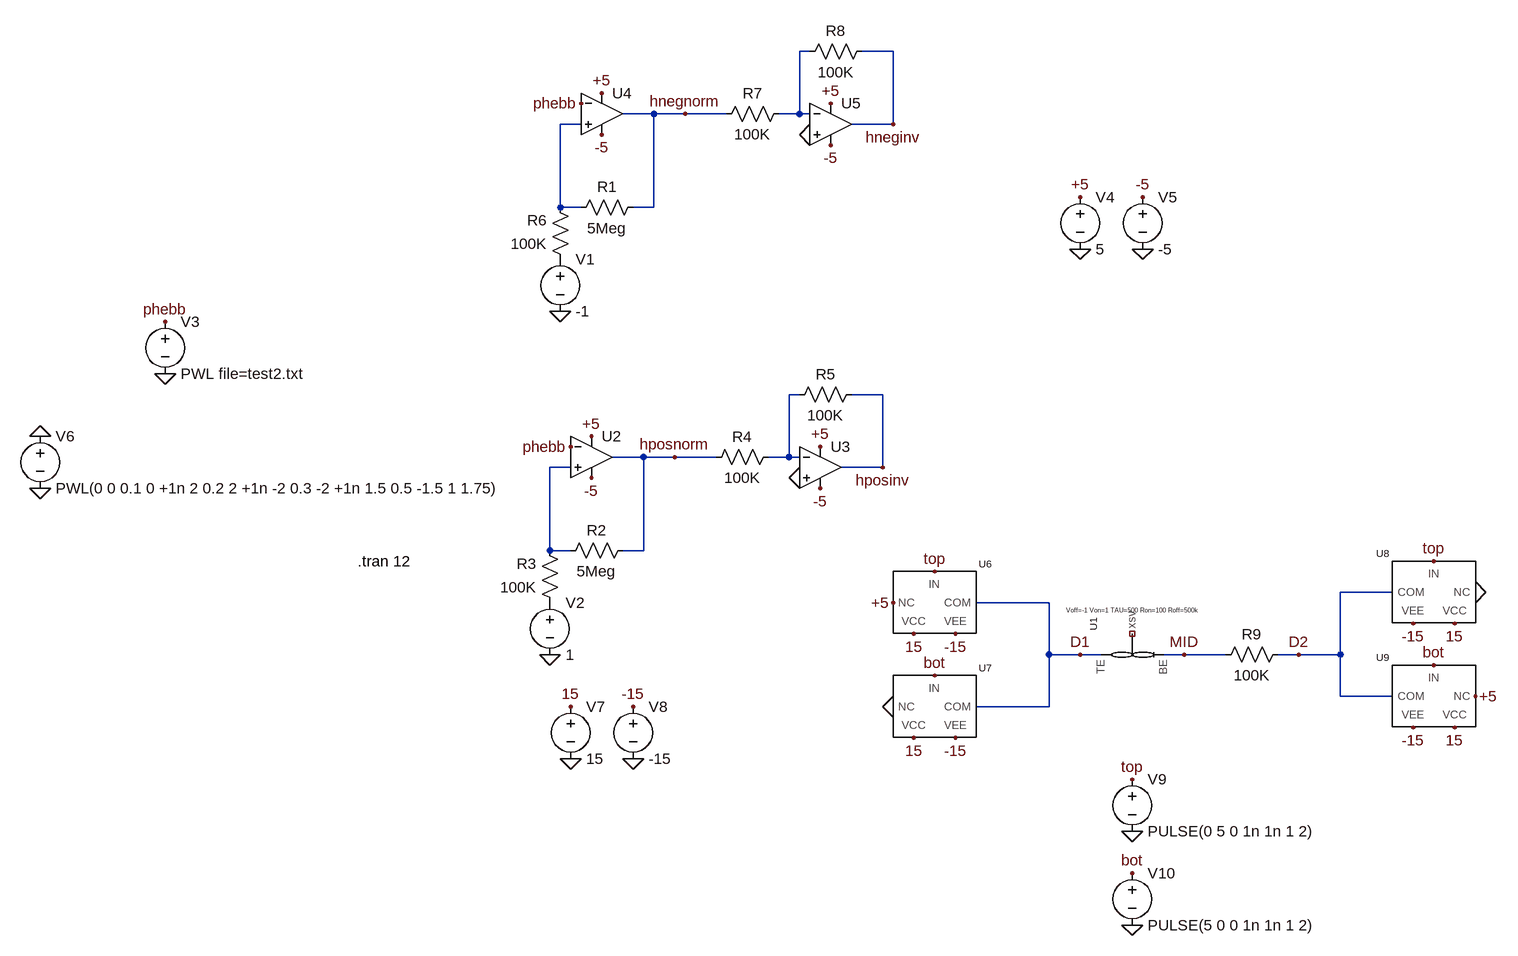
[diagram p0: schematic Draft1.asc]
Draft1.asc, the LTspice schematic file:
Version 4
SHEET 1 1284 1088
WIRE 128 -448 112 -448
WIRE 256 -448 208 -448
WIRE -112 -352 -160 -352
WIRE -64 -352 -112 -352
WIRE 0 -352 -64 -352
WIRE 112 -352 112 -448
WIRE 112 -352 80 -352
WIRE 128 -352 112 -352
WIRE -224 -336 -256 -336
WIRE 256 -336 256 -448
WIRE 256 -336 192 -336
WIRE -256 -208 -256 -336
WIRE -224 -208 -256 -208
WIRE -112 -208 -112 -352
WIRE -112 -208 -144 -208
WIRE 112 80 96 80
WIRE 240 80 192 80
WIRE -128 176 -176 176
WIRE -80 176 -128 176
WIRE -16 176 -80 176
WIRE 96 176 96 80
WIRE 96 176 64 176
WIRE 112 176 96 176
WIRE -240 192 -272 192
WIRE 240 192 240 80
WIRE 240 192 176 192
WIRE -272 320 -272 192
WIRE -240 320 -272 320
WIRE -128 320 -128 176
WIRE -128 320 -160 320
WIRE 1024 384 944 384
WIRE 496 400 384 400
WIRE 496 480 496 400
WIRE 544 480 496 480
WIRE 576 480 544 480
WIRE 704 480 672 480
WIRE 768 480 704 480
WIRE 880 480 848 480
WIRE 944 480 944 384
WIRE 944 480 880 480
WIRE 944 544 944 480
WIRE 1024 544 944 544
WIRE 496 560 496 480
WIRE 496 560 384 560
FLAG -208 144 +5
FLAG -272 480 0
FLAG 112 208 0
FLAG 144 160 +5
FLAG -80 176 hposnorm
FLAG 240 192 hposinv
FLAG -864 48 0
FLAG -864 -32 phebb
FLAG -192 -384 +5
FLAG -256 -48 0
FLAG 128 -320 0
FLAG 160 -368 +5
FLAG -64 -352 hnegnorm
FLAG 256 -336 hneginv
FLAG -240 160 phebb
FLAG -224 -368 phebb
FLAG 544 -224 +5
FLAG 640 -224 -5
FLAG 544 -144 0
FLAG 640 -144 0
FLAG 160 -304 -5
FLAG -192 -320 -5
FLAG -208 208 -5
FLAG 144 224 -5
FLAG -1056 224 0
FLAG -1056 144 0
FLAG -240 640 0
FLAG -144 640 0
FLAG -240 560 15
FLAG -144 560 -15
FLAG 352 448 -15
FLAG 288 448 15
FLAG 256 400 +5
FLAG 256 560 0
FLAG 544 480 D1
FLAG 880 480 D2
FLAG 704 480 MID
FLAG 288 608 15
FLAG 352 608 -15
FLAG 1056 592 -15
FLAG 1120 592 15
FLAG 1152 544 +5
FLAG 1152 384 0
FLAG 1120 432 15
FLAG 1056 432 -15
FLAG 320 352 top
FLAG 1088 336 top
FLAG 320 512 bot
FLAG 1088 496 bot
FLAG 624 752 0
FLAG 624 896 0
FLAG 624 672 top
FLAG 624 816 bot
SYMBOL memristor_with_state 624 480 R270
WINDOW 3 68 0 VCenter 0
SYMATTR Value Voff=-1 Von=1 TAU=500 Ron=100 Roff=500k
SYMATTR InstName U1
SYMBOL Opamps\\UniversalOpamp2 -208 176 R0
SYMATTR InstName U2
SYMBOL res -144 304 R90
WINDOW 0 0 56 VBottom 2
WINDOW 3 32 56 VTop 2
SYMATTR InstName R2
SYMATTR Value 5Meg
SYMBOL res -256 416 R180
WINDOW 0 36 76 Left 2
WINDOW 3 36 40 Left 2
SYMATTR InstName R3
SYMATTR Value 100K
SYMBOL voltage -272 384 R0
WINDOW 123 0 0 Left 2
WINDOW 39 0 0 Left 2
SYMATTR InstName V2
SYMATTR Value 1
SYMBOL Opamps\\UniversalOpamp2 144 192 R0
SYMATTR InstName U3
SYMBOL res 80 160 R90
WINDOW 0 0 56 VBottom 2
WINDOW 3 32 56 VTop 2
SYMATTR InstName R4
SYMATTR Value 100K
SYMBOL res 208 64 R90
WINDOW 0 0 56 VBottom 2
WINDOW 3 32 56 VTop 2
SYMATTR InstName R5
SYMATTR Value 100K
SYMBOL voltage -864 -48 R0
WINDOW 123 0 0 Left 2
WINDOW 39 0 0 Left 2
SYMATTR InstName V3
SYMATTR Value PWL file=test2.txt
SYMBOL Opamps\\UniversalOpamp2 -192 -352 R0
SYMATTR InstName U4
SYMBOL res -128 -224 R90
WINDOW 0 0 56 VBottom 2
WINDOW 3 32 56 VTop 2
SYMATTR InstName R1
SYMATTR Value 5Meg
SYMBOL res -240 -112 R180
WINDOW 0 36 76 Left 2
WINDOW 3 36 40 Left 2
SYMATTR InstName R6
SYMATTR Value 100K
SYMBOL voltage -256 -144 R0
WINDOW 123 0 0 Left 2
WINDOW 39 0 0 Left 2
SYMATTR InstName V1
SYMATTR Value -1
SYMBOL Opamps\\UniversalOpamp2 160 -336 R0
SYMATTR InstName U5
SYMBOL res 96 -368 R90
WINDOW 0 0 56 VBottom 2
WINDOW 3 32 56 VTop 2
SYMATTR InstName R7
SYMATTR Value 100K
SYMBOL res 224 -464 R90
WINDOW 0 0 56 VBottom 2
WINDOW 3 32 56 VTop 2
SYMATTR InstName R8
SYMATTR Value 100K
SYMBOL voltage 544 -240 R0
WINDOW 123 0 0 Left 2
WINDOW 39 0 0 Left 2
SYMATTR InstName V4
SYMATTR Value 5
SYMBOL voltage 640 -240 R0
WINDOW 123 0 0 Left 2
WINDOW 39 0 0 Left 2
SYMATTR InstName V5
SYMATTR Value -5
SYMBOL voltage -1056 128 R0
WINDOW 123 0 0 Left 2
WINDOW 39 0 0 Left 2
SYMATTR InstName V6
SYMATTR Value PWL(0 0 0.1 0 +1n 2 0.2 2 +1n -2 0.3 -2 +1n 1.5 0.5 -1.5 1 1.75)
SYMBOL res 864 464 R90
WINDOW 0 0 56 VBottom 2
WINDOW 3 32 56 VTop 2
SYMATTR InstName R9
SYMATTR Value 100K
SYMBOL voltage -240 544 R0
WINDOW 123 0 0 Left 2
WINDOW 39 0 0 Left 2
SYMATTR InstName V7
SYMATTR Value 15
SYMBOL voltage -144 544 R0
WINDOW 123 0 0 Left 2
WINDOW 39 0 0 Left 2
SYMATTR InstName V8
SYMATTR Value -15
SYMBOL MemristiveBrain\\TS12A4517 320 400 R0
SYMATTR InstName U6
SYMBOL MemristiveBrain\\TS12A4517 320 560 R0
SYMATTR InstName U7
SYMBOL MemristiveBrain\\TS12A4517 1088 384 M0
SYMATTR InstName U8
SYMBOL MemristiveBrain\\TS12A4517 1088 544 M0
SYMATTR InstName U9
SYMBOL voltage 624 656 R0
WINDOW 123 0 0 Left 0
WINDOW 39 0 0 Left 0
SYMATTR InstName V9
SYMATTR Value PULSE(0 5 0 1n 1n 1 2)
SYMBOL voltage 624 800 R0
WINDOW 123 0 0 Left 0
WINDOW 39 0 0 Left 0
SYMATTR InstName V10
SYMATTR Value PULSE(5 0 0 1n 1n 1 2)
TEXT -568 336 Left 2 !.tran 12

The netlist it stands for:
* Draft1.asc
XU1 D1 MID NC_01 MEM_JOGLEKAR Voff=-1 Von=1 TAU=500 Ron=100 Roff=500k  ; pins TE BE xsv
XU2 N004 phebb +5 -5 hposnorm level.2 Avol=1Meg GBW=10Meg Slew=10Meg ilimit=25m rail=0 Vos=0 phimargin=45 en=0 enk=0 in=0 ink=0 Rin=500Meg  ; pins IN+ IN- V+ V- OUT
R2 hposnorm N004 5Meg
R3 P001 N004 100K
V2 P001 0 1
XU3 0 N003 +5 -5 hposinv level.2 Avol=1Meg GBW=10Meg Slew=10Meg ilimit=25m rail=0 Vos=0 phimargin=45 en=0 enk=0 in=0 ink=0 Rin=500Meg  ; pins IN+ IN- V+ V- OUT
R4 N003 hposnorm 100K
R5 hposinv N003 100K
V3 phebb 0 PWL file=test2.txt
XU4 N002 phebb +5 -5 hnegnorm level.2 Avol=1Meg GBW=10Meg Slew=10Meg ilimit=25m rail=0 Vos=0 phimargin=45 en=0 enk=0 in=0 ink=0 Rin=500Meg  ; pins IN+ IN- V+ V- OUT
R1 hnegnorm N002 5Meg
R6 P002 N002 100K
V1 P002 0 -1
XU5 0 N001 +5 -5 hneginv level.2 Avol=1Meg GBW=10Meg Slew=10Meg ilimit=25m rail=0 Vos=0 phimargin=45 en=0 enk=0 in=0 ink=0 Rin=500Meg  ; pins IN+ IN- V+ V- OUT
R7 N001 hnegnorm 100K
R8 hneginv N001 100K
V4 +5 0 5
V5 -5 0 -5
V6 0 0 PWL(0 0 0.1 0 +1n 2 0.2 2 +1n -2 0.3 -2 +1n 1.5 0.5 -1.5 1 1.75)
R9 D2 MID 100K
V7 15 0 15
V8 -15 0 -15
XU6 top +5 D1 15 -15 TS12A4517  ; pins IN NC COM VCC VEE
XU7 bot 0 D1 15 -15 TS12A4517  ; pins IN NC COM VCC VEE
XU8 top 0 D2 15 -15 TS12A4517  ; pins IN NC COM VCC VEE
XU9 bot +5 D2 15 -15 TS12A4517  ; pins IN NC COM VCC VEE
V9 top 0 PULSE(0 5 0 1n 1n 1 2)
V10 bot 0 PULSE(5 0 0 1n 1n 1 2)
.tran 12
.lib memristor_with_state.sub
.lib UniversalOpamps2.sub
.backanno
.end